# EAGLE schematic 4ESC v3.1.1 (EAGLE 6.5.0)

## Sheet 1 of 5
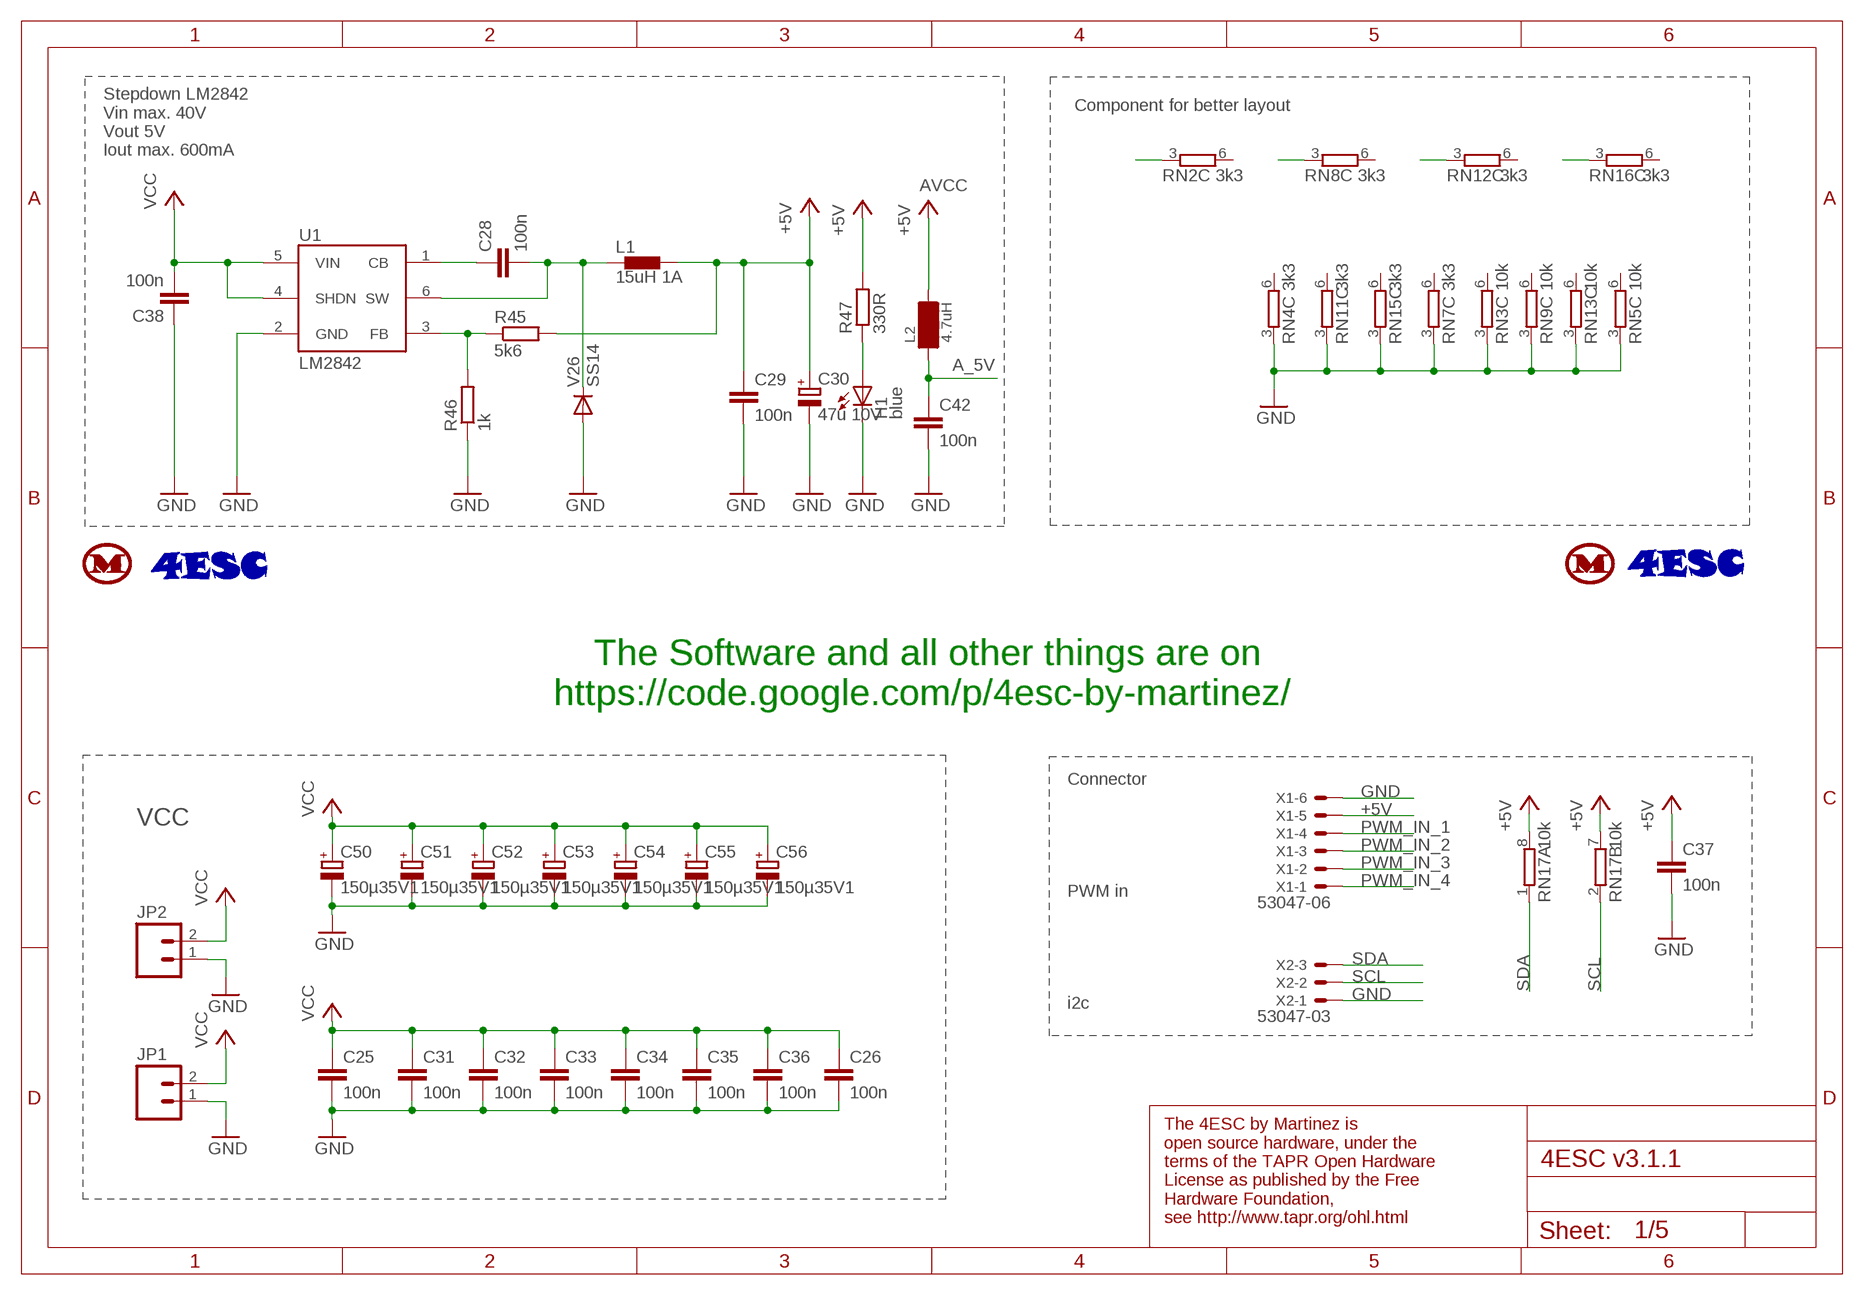
[diagram p0: schematic, sheet 1]

### Parts
C25  100n  C-EUC0603K  [C0603K]
C26  100n  C-EUC0603K  [C0603K]
C28  100n  C-EUC0603K  [C0603K]
C29  100n  C-EUC0603K  [C0603K]
C30  47u 10V  CPOL-EUC/6032-28R  [C/6032-28R]
C31  100n  C-EUC0603K  [C0603K]
C32  100n  C-EUC0603K  [C0603K]
C33  100n  C-EUC0603K  [C0603K]
C34  100n  C-EUC0603K  [C0603K]
C35  100n  C-EUC0603K  [C0603K]
C36  100n  C-EUC0603K  [C0603K]
C37  100n  C-EUC0603K  [C0603K]
C38  100n  C-EUC1206  [C1206]
C42  100n  C-EUC0603K  [C0603K]
C50  150µ35V1  CPOL-EU  [ELKO_MARTINEZ]
C51  150µ35V1  CPOL-EU  [ELKO_MARTINEZ]
C52  150µ35V1  CPOL-EU  [ELKO_MARTINEZ]
C53  150µ35V1  CPOL-EU  [ELKO_MARTINEZ]
C54  150µ35V1  CPOL-EU  [ELKO_MARTINEZ]
C55  150µ35V1  CPOL-EU  [ELKO_MARTINEZ]
C56  150µ35V1  CPOL-EU  [ELKO_MARTINEZ]
H1  blue  LEDCHIPLED_0603  [CHIPLED_0603]
JP1  M021X02_NO_SILK  [1X02_NO_SILK]
JP2  M021X02_NO_SILK  [1X02_NO_SILK]
L1  15uH 1A  SUMIDA-CDRH4D28CDRH4D28  [CDRH4D28]
L2  4.7uH  L0805  [L0805]
R45  5k6  R-EU_R0603  [R0603]
R46  1k  R-EU_R0603  [R0603]
R47  330R  R-EU_R0603  [R0603]
RN2  3k3  4R-N0402ARV341  [4X0402ARV341]
RN3  10k  4R-N0402ARV341  [4X0402ARV341]
RN4  3k3  4R-N0402ARV341  [4X0402ARV341]
RN5  10k  4R-N0402ARV341  [4X0402ARV341]
RN7  3k3  4R-N0402ARV341  [4X0402ARV341]
RN8  3k3  4R-N0402ARV341  [4X0402ARV341]
RN9  10k  4R-N0402ARV341  [4X0402ARV341]
RN11  3k3  4R-N0402ARV341  [4X0402ARV341]
RN12  3k3  4R-N0402ARV341  [4X0402ARV341]
RN13  10k  4R-N0402ARV341  [4X0402ARV341]
RN15  3k3  4R-N0402ARV341  [4X0402ARV341]
RN16  3k3  4R-N0402ARV341  [4X0402ARV341]
RN17  10k  4R-N0402ARV341  [4X0402ARV341]
U1  LM2842  [SOT23-6]
U$1  M  [M]
U$2  M  [M]
U$3  4ESC_05MM  [4ESC_05MM_HOCH]
U$4  4ESC_05MM  [4ESC_05MM_HOCH]
V26  SS14  DIODE-DO214AC  [DO214AC]
X1  53047-06  [53047-06]
X2  53047-03  [53047-03]

### Nets
+5V: C29.1 C30.+ C37.1 L1.P$2 L2.2 R45.2 R47.2 RN17.7 RN17.8 X1.5 ; also sheet 2,3,4,5
A_5V: C42.1 L2.1 ; also sheet 2,3,4,5
GND: C25.2 C26.2 C29.2 C30.- C31.2 C32.2 C33.2 C34.2 C35.2 C36.2 C37.2 C38.1 C42.2 C50.- C50.-1(-) C51.- C51.-1(-) C52.- C52.-1(-) C53.- C53.-1(-) C54.- C54.-1(-) C55.- C55.-1(-) C56.- C56.-1(-) H1.C JP1.1 JP2.1 R46.1 RN3.3 RN4.3 RN5.3 RN7.3 RN9.3 RN11.3 RN13.3 RN15.3 U1.2(GND) V26.A X1.6 X2.1 ; also sheet 2,3,4,5
N$20: C28.2 L1.P$1 U1.6(SW) V26.C
N$34: C28.1 U1.1(CB)
N$47: R45.1 R46.2 U1.3(FB)
N$60: H1.A R47.1
PWM_IN_1: X1.4 ; also sheet 2
PWM_IN_2: X1.3 ; also sheet 3
PWM_IN_3: X1.2 ; also sheet 4
PWM_IN_4: X1.1 ; also sheet 5
SCL: RN17.2 X2.2 ; also sheet 2,3,4,5
SDA: RN17.1 X2.3 ; also sheet 2,3,4,5
SENSE_STAR_1: RN2.3 ; also sheet 2
SENSE_STAR_2: RN8.3 ; also sheet 3
SENSE_STAR_3: RN12.3 ; also sheet 4
SENSE_STAR_4: RN16.3 ; also sheet 5
VCC: C25.1 C26.1 C31.1 C32.1 C33.1 C34.1 C35.1 C36.1 C38.2 C50.+ C50.+1(+) C51.+ C51.+1(+) C52.+ C52.+1(+) C53.+ C53.+1(+) C54.+ C54.+1(+) C55.+ C55.+1(+) C56.+ C56.+1(+) JP1.2 JP2.2 U1.4(SHDN) U1.5(VIN) ; also sheet 2,3,4,5
Unconnected: RN2.6 RN3.6 RN4.6 RN5.6 RN7.6 RN8.6 RN9.6 RN11.6 RN12.6 RN13.6 RN15.6 RN16.6 RN17.3 RN17.4 RN17.5 RN17.6

### Notes on the sheet
- Component for better layout
- Stepdown LM2842
  Vin max. 40V
  Vout 5V
  Iout max. 600mA
- AVCC
- The Software and all other things are on
  https://code.google.com/p/4esc-by-martinez/
- VCC
- Connector
  
  
  
  
  
  PWM in
  
  
  
  
  
  i2c
- The 4ESC by Martinez is
  open source hardware, under the
  terms of the TAPR Open Hardware
  License as published by the Free
  Hardware Foundation,
  see http://www.tapr.org/ohl.html

## Sheet 2 of 5
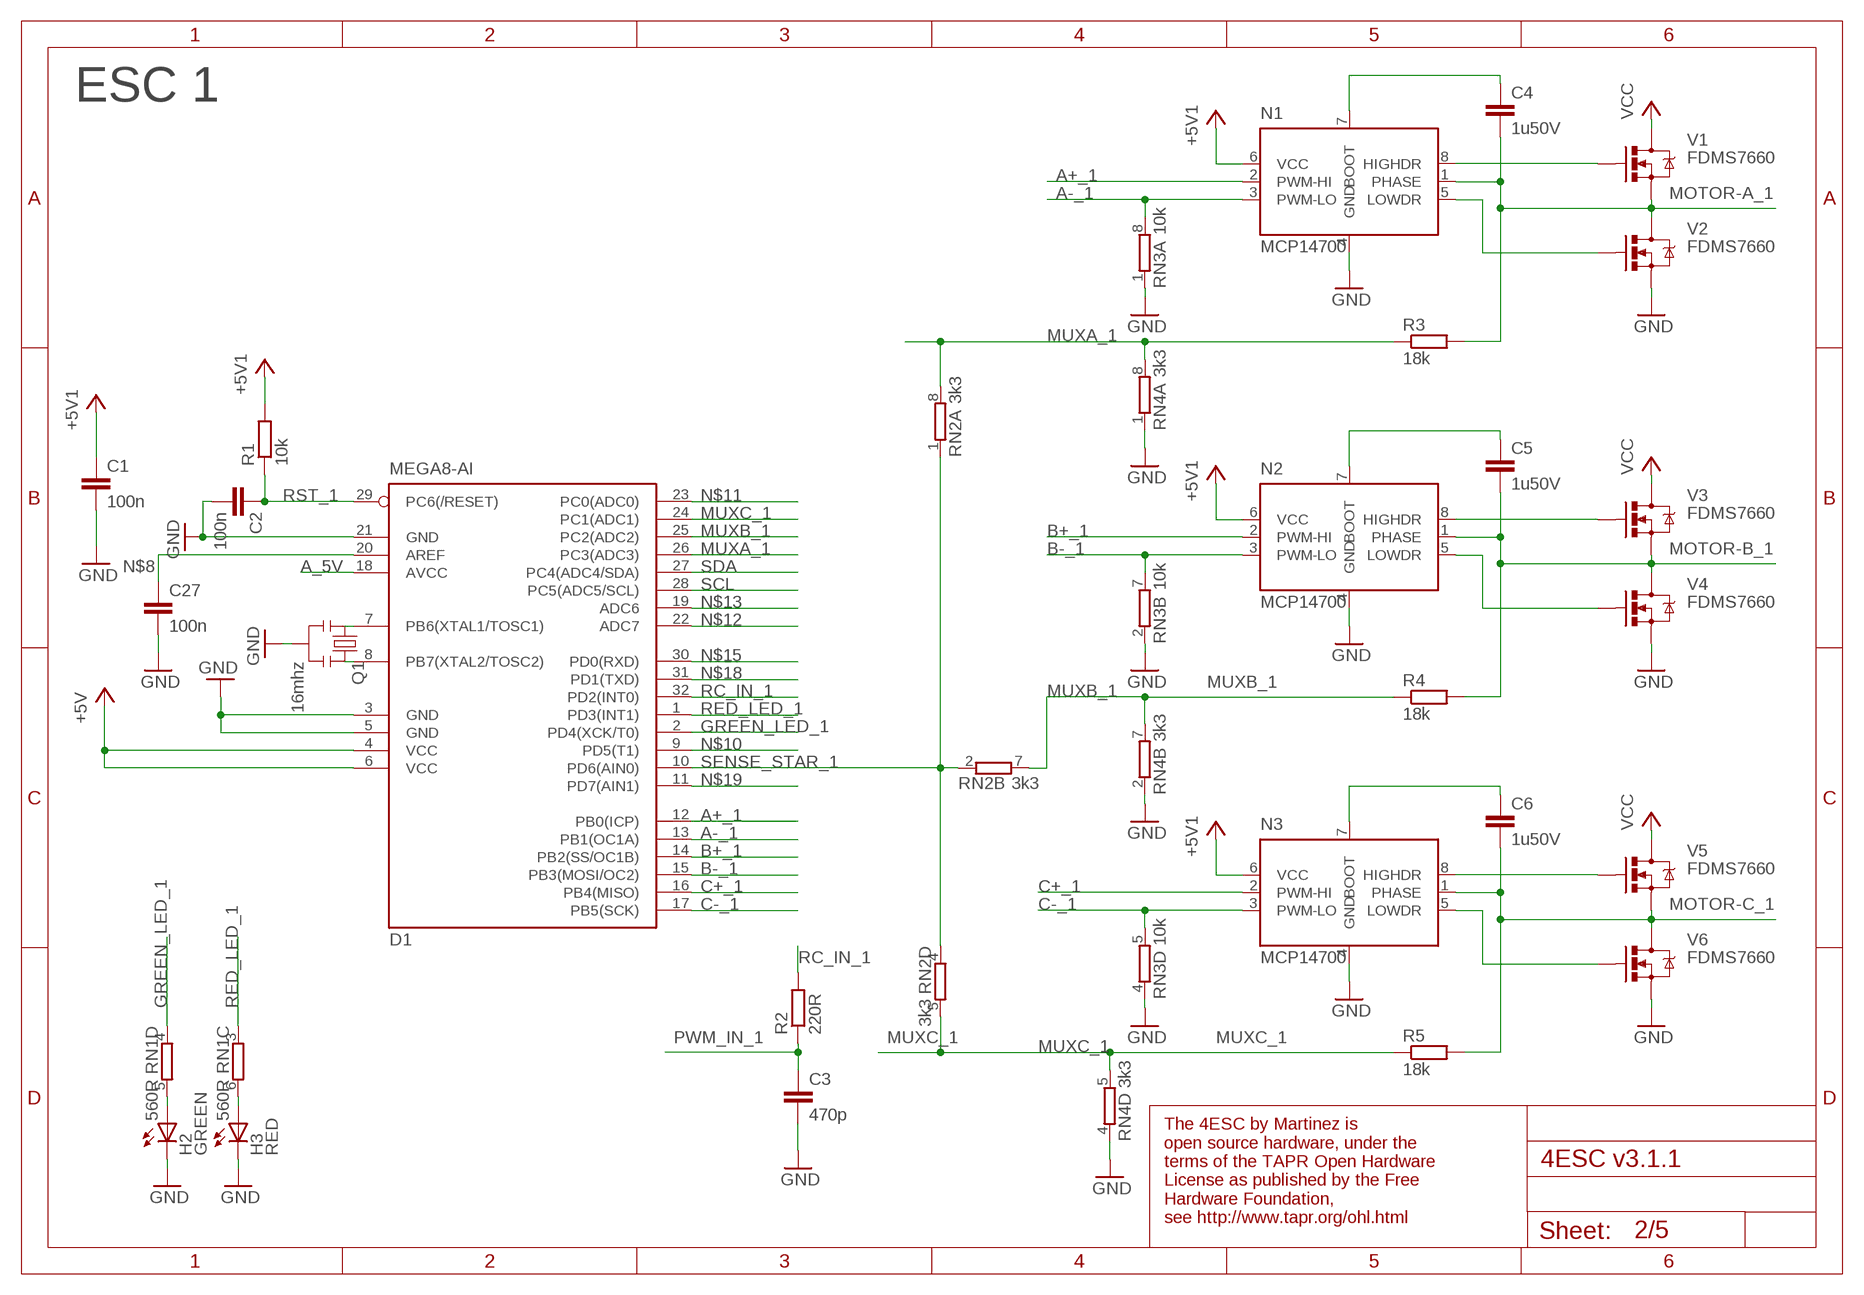
[diagram p1: schematic, sheet 2]

### Parts
C1  100n  C-EUC0603K  [C0603K]
C2  100n  C-EUC0603K  [C0603K]
C3  470p  C-EUC0603K  [C0603K]
C4  1u50V  C-EUC0805K  [C0805K]
C5  1u50V  C-EUC0805K  [C0805K]
C6  1u50V  C-EUC0805K  [C0805K]
C27  100n  C-EUC0603K  [C0603K]
D1  MEGA8-AI  [TQFP32-08]
H2  GREEN  LEDCHIPLED_0603  [CHIPLED_0603]
H3  RED  LEDCHIPLED_0603  [CHIPLED_0603]
N1  MCP14700  [DFN3X3P8]
N2  MCP14700  [DFN3X3P8]
N3  MCP14700  [DFN3X3P8]
Q1  16mhz  RESONATORSMD  [RESONATOR-SMD]
R1  10k  R-EU_R0603  [R0603]
R2  220R  R-EU_R0603  [R0603]
R3  18k  R-EU_R0603  [R0603]
R4  18k  R-EU_R0603  [R0603]
R5  18k  R-EU_R0603  [R0603]
RN1  560R  4R-N0402ARV341  [4X0402ARV341]
V1  FDMS7660  [POWER56]
V2  FDMS7660  [POWER56]
V3  FDMS7660  [POWER56]
V4  FDMS7660  [POWER56]
V5  FDMS7660  [POWER56]
V6  FDMS7660  [POWER56]

### Nets
+5V: C1.1 D1.4(VCC) D1.6(VCC) N1.6(VCC) N2.6(VCC) N3.6(VCC) R1.2 ; supply symbol labelled +5V1 ; also sheet 1,3,4,5
A+_1: D1.12(PB0(ICP)) N1.2(PWM-HI)
A-_1: D1.13(PB1(OC1A)) N1.3(PWM-LO) RN3.8
A_5V: D1.18(AVCC) ; also sheet 1,3,4,5
B+_1: D1.14(PB2(SS/OC1B)) N2.2(PWM-HI)
B-_1: D1.15(PB3(MOSI/OC2)) N2.3(PWM-LO) RN3.7
C+_1: D1.16(PB4(MISO)) N3.2(PWM-HI)
C-_1: D1.17(PB5(SCK)) N3.3(PWM-LO) RN3.5
GND: C1.2 C2.2 C3.2 C27.2 D1.3(GND) D1.5(GND) D1.21(GND) H2.C H3.C N1.4(GND) N2.4(GND) N3.4(GND) Q1.2 RN3.1 RN3.2 RN3.4 RN4.1 RN4.2 RN4.4 V2.P$1(S) V2.P$2(S) V2.P$3(S) V4.P$1(S) V4.P$2(S) V4.P$3(S) V6.P$1(S) V6.P$2(S) V6.P$3(S) ; also sheet 1,3,4,5
GREEN_LED_1: D1.2(PD4(XCK/T0)) RN1.4
MOTOR-A_1: C4.2 N1.1(PHASE) R3.2 V1.P$1(S) V1.P$2(S) V1.P$3(S) V2.P$5(D) V2.P$6(D) V2.P$7(D) V2.P$8(D) V2.P$9(D)
MOTOR-B_1: C5.2 N2.1(PHASE) R4.2 V3.P$1(S) V3.P$2(S) V3.P$3(S) V4.P$5(D) V4.P$6(D) V4.P$7(D) V4.P$8(D) V4.P$9(D)
MOTOR-C_1: C6.2 N3.1(PHASE) R5.2 V5.P$1(S) V5.P$2(S) V5.P$3(S) V6.P$5(D) V6.P$6(D) V6.P$7(D) V6.P$8(D) V6.P$9(D)
MUXA_1: D1.26(PC3(ADC3)) R3.1 RN2.8 RN4.8
MUXB_1: D1.25(PC2(ADC2)) R4.1 RN2.7 RN4.7
MUXC_1: D1.24(PC1(ADC1)) R5.1 RN2.5 RN4.5
N$1: N1.5(LOWDR) V2.P$4(G)
N$2: N2.5(LOWDR) V4.P$4(G)
N$2_1: D1.8(PB7(XTAL2/TOSC2)) Q1.3
N$3: N3.5(LOWDR) V6.P$4(G)
N$3_1: D1.7(PB6(XTAL1/TOSC1)) Q1.1
N$4: H3.A RN1.6
N$5: H2.A RN1.5
N$8: C27.1 D1.20(AREF)
N$10: D1.9(PD5(T1))
N$11: D1.23(PC0(ADC0))
N$12: D1.22(ADC7)
N$13: D1.19(ADC6)
N$15: D1.30(PD0(RXD))
N$16_1: N1.8(HIGHDR) V1.P$4(G)
N$16_2: N2.8(HIGHDR) V3.P$4(G)
N$16_3: N3.8(HIGHDR) V5.P$4(G)
N$18: D1.31(PD1(TXD))
N$19: D1.11(PD7(AIN1))
N$78_1: C4.1 N1.7(BOOT)
N$78_2: C5.1 N2.7(BOOT)
N$78_3: C6.1 N3.7(BOOT)
PWM_IN_1: C3.1 R2.1 ; also sheet 1
RC_IN_1: D1.32(PD2(INT0)) R2.2
RED_LED_1: D1.1(PD3(INT1)) RN1.3
RST_1: C2.1 D1.29(PC6(/RESET)) R1.1
SCL: D1.28(PC5(ADC5/SCL)) ; also sheet 1,3,4,5
SDA: D1.27(PC4(ADC4/SDA)) ; also sheet 1,3,4,5
SENSE_STAR_1: D1.10(PD6(AIN0)) RN2.1 RN2.2 RN2.4 ; also sheet 1
VCC: V1.P$5(D) V1.P$6(D) V1.P$7(D) V1.P$8(D) V1.P$9(D) V3.P$5(D) V3.P$6(D) V3.P$7(D) V3.P$8(D) V3.P$9(D) V5.P$5(D) V5.P$6(D) V5.P$7(D) V5.P$8(D) V5.P$9(D) ; also sheet 1,3,4,5
Unconnected: RN1.1 RN1.2 RN1.7 RN1.8

### Notes on the sheet
- ESC 1
- The 4ESC by Martinez is
  open source hardware, under the
  terms of the TAPR Open Hardware
  License as published by the Free
  Hardware Foundation,
  see http://www.tapr.org/ohl.html

## Sheet 3 of 5
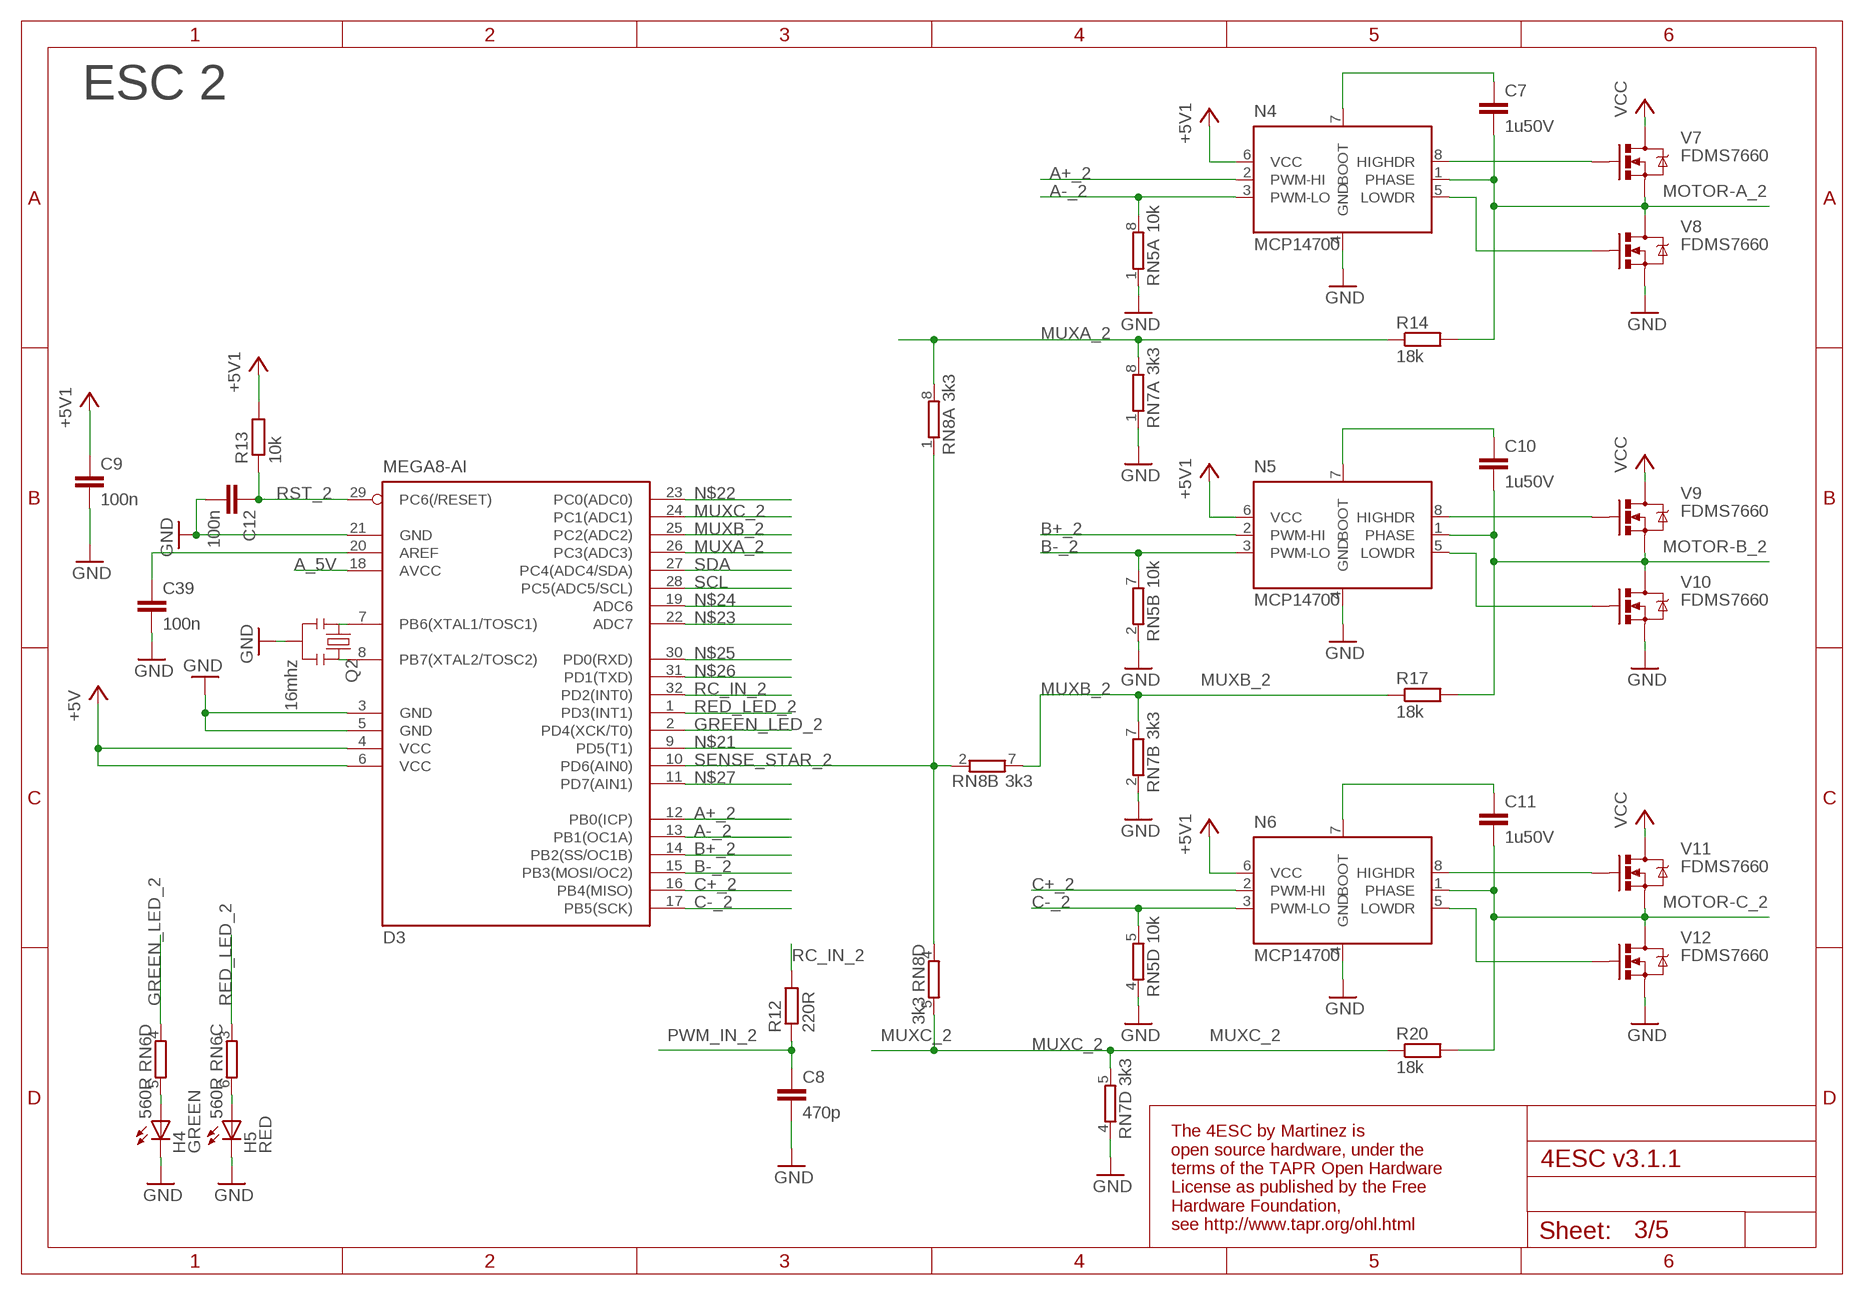
[diagram p2: schematic, sheet 3]

### Parts
C7  1u50V  C-EUC0805K  [C0805K]
C8  470p  C-EUC0603K  [C0603K]
C9  100n  C-EUC0603K  [C0603K]
C10  1u50V  C-EUC0805K  [C0805K]
C11  1u50V  C-EUC0805K  [C0805K]
C12  100n  C-EUC0603K  [C0603K]
C39  100n  C-EUC0603K  [C0603K]
D3  MEGA8-AI  [TQFP32-08]
H4  GREEN  LEDCHIPLED_0603  [CHIPLED_0603]
H5  RED  LEDCHIPLED_0603  [CHIPLED_0603]
N4  MCP14700  [DFN3X3P8]
N5  MCP14700  [DFN3X3P8]
N6  MCP14700  [DFN3X3P8]
Q2  16mhz  RESONATORSMD  [RESONATOR-SMD]
R12  220R  R-EU_R0603  [R0603]
R13  10k  R-EU_R0603  [R0603]
R14  18k  R-EU_R0603  [R0603]
R17  18k  R-EU_R0603  [R0603]
R20  18k  R-EU_R0603  [R0603]
RN6  560R  4R-N0402ARV341  [4X0402ARV341]
V7  FDMS7660  [POWER56]
V8  FDMS7660  [POWER56]
V9  FDMS7660  [POWER56]
V10  FDMS7660  [POWER56]
V11  FDMS7660  [POWER56]
V12  FDMS7660  [POWER56]

### Nets
+5V: C9.1 D3.4(VCC) D3.6(VCC) N4.6(VCC) N5.6(VCC) N6.6(VCC) R13.2 ; supply symbol labelled +5V1 ; also sheet 1,2,4,5
A+_2: D3.12(PB0(ICP)) N4.2(PWM-HI)
A-_2: D3.13(PB1(OC1A)) N4.3(PWM-LO) RN5.8
A_5V: D3.18(AVCC) ; also sheet 1,2,4,5
B+_2: D3.14(PB2(SS/OC1B)) N5.2(PWM-HI)
B-_2: D3.15(PB3(MOSI/OC2)) N5.3(PWM-LO) RN5.7
C+_2: D3.16(PB4(MISO)) N6.2(PWM-HI)
C-_2: D3.17(PB5(SCK)) N6.3(PWM-LO) RN5.5
GND: C8.2 C9.2 C12.2 C39.2 D3.3(GND) D3.5(GND) D3.21(GND) H4.C H5.C N4.4(GND) N5.4(GND) N6.4(GND) Q2.2 RN5.1 RN5.2 RN5.4 RN7.1 RN7.2 RN7.4 V8.P$1(S) V8.P$2(S) V8.P$3(S) V10.P$1(S) V10.P$2(S) V10.P$3(S) V12.P$1(S) V12.P$2(S) V12.P$3(S) ; also sheet 1,2,4,5
GREEN_LED_2: D3.2(PD4(XCK/T0)) RN6.4
MOTOR-A_2: C7.2 N4.1(PHASE) R14.2 V7.P$1(S) V7.P$2(S) V7.P$3(S) V8.P$5(D) V8.P$6(D) V8.P$7(D) V8.P$8(D) V8.P$9(D)
MOTOR-B_2: C10.2 N5.1(PHASE) R17.2 V9.P$1(S) V9.P$2(S) V9.P$3(S) V10.P$5(D) V10.P$6(D) V10.P$7(D) V10.P$8(D) V10.P$9(D)
MOTOR-C_2: C11.2 N6.1(PHASE) R20.2 V11.P$1(S) V11.P$2(S) V11.P$3(S) V12.P$5(D) V12.P$6(D) V12.P$7(D) V12.P$8(D) V12.P$9(D)
MUXA_2: D3.26(PC3(ADC3)) R14.1 RN7.8 RN8.8
MUXB_2: D3.25(PC2(ADC2)) R17.1 RN7.7 RN8.7
MUXC_2: D3.24(PC1(ADC1)) R20.1 RN7.5 RN8.5
N$2_2: D3.8(PB7(XTAL2/TOSC2)) Q2.3
N$3_2: D3.7(PB6(XTAL1/TOSC1)) Q2.1
N$6: N4.5(LOWDR) V8.P$4(G)
N$9: N5.5(LOWDR) V10.P$4(G)
N$14: N6.5(LOWDR) V12.P$4(G)
N$16: H4.A RN6.5
N$16_4: N4.8(HIGHDR) V7.P$4(G)
N$16_5: N5.8(HIGHDR) V9.P$4(G)
N$16_6: N6.8(HIGHDR) V11.P$4(G)
N$17: C39.1 D3.20(AREF)
N$21: D3.9(PD5(T1))
N$22: D3.23(PC0(ADC0))
N$23: D3.22(ADC7)
N$24: D3.19(ADC6)
N$25: D3.30(PD0(RXD))
N$26: D3.31(PD1(TXD))
N$27: D3.11(PD7(AIN1))
N$28: H5.A RN6.6
N$78_4: C7.1 N4.7(BOOT)
N$78_5: C10.1 N5.7(BOOT)
N$78_6: C11.1 N6.7(BOOT)
PWM_IN_2: C8.1 R12.1 ; also sheet 1
RC_IN_2: D3.32(PD2(INT0)) R12.2
RED_LED_2: D3.1(PD3(INT1)) RN6.3
RST_2: C12.1 D3.29(PC6(/RESET)) R13.1
SCL: D3.28(PC5(ADC5/SCL)) ; also sheet 1,2,4,5
SDA: D3.27(PC4(ADC4/SDA)) ; also sheet 1,2,4,5
SENSE_STAR_2: D3.10(PD6(AIN0)) RN8.1 RN8.2 RN8.4 ; also sheet 1
VCC: V7.P$5(D) V7.P$6(D) V7.P$7(D) V7.P$8(D) V7.P$9(D) V9.P$5(D) V9.P$6(D) V9.P$7(D) V9.P$8(D) V9.P$9(D) V11.P$5(D) V11.P$6(D) V11.P$7(D) V11.P$8(D) V11.P$9(D) ; also sheet 1,2,4,5
Unconnected: RN6.1 RN6.2 RN6.7 RN6.8

### Notes on the sheet
- ESC 2
- The 4ESC by Martinez is
  open source hardware, under the
  terms of the TAPR Open Hardware
  License as published by the Free
  Hardware Foundation,
  see http://www.tapr.org/ohl.html

## Sheet 4 of 5
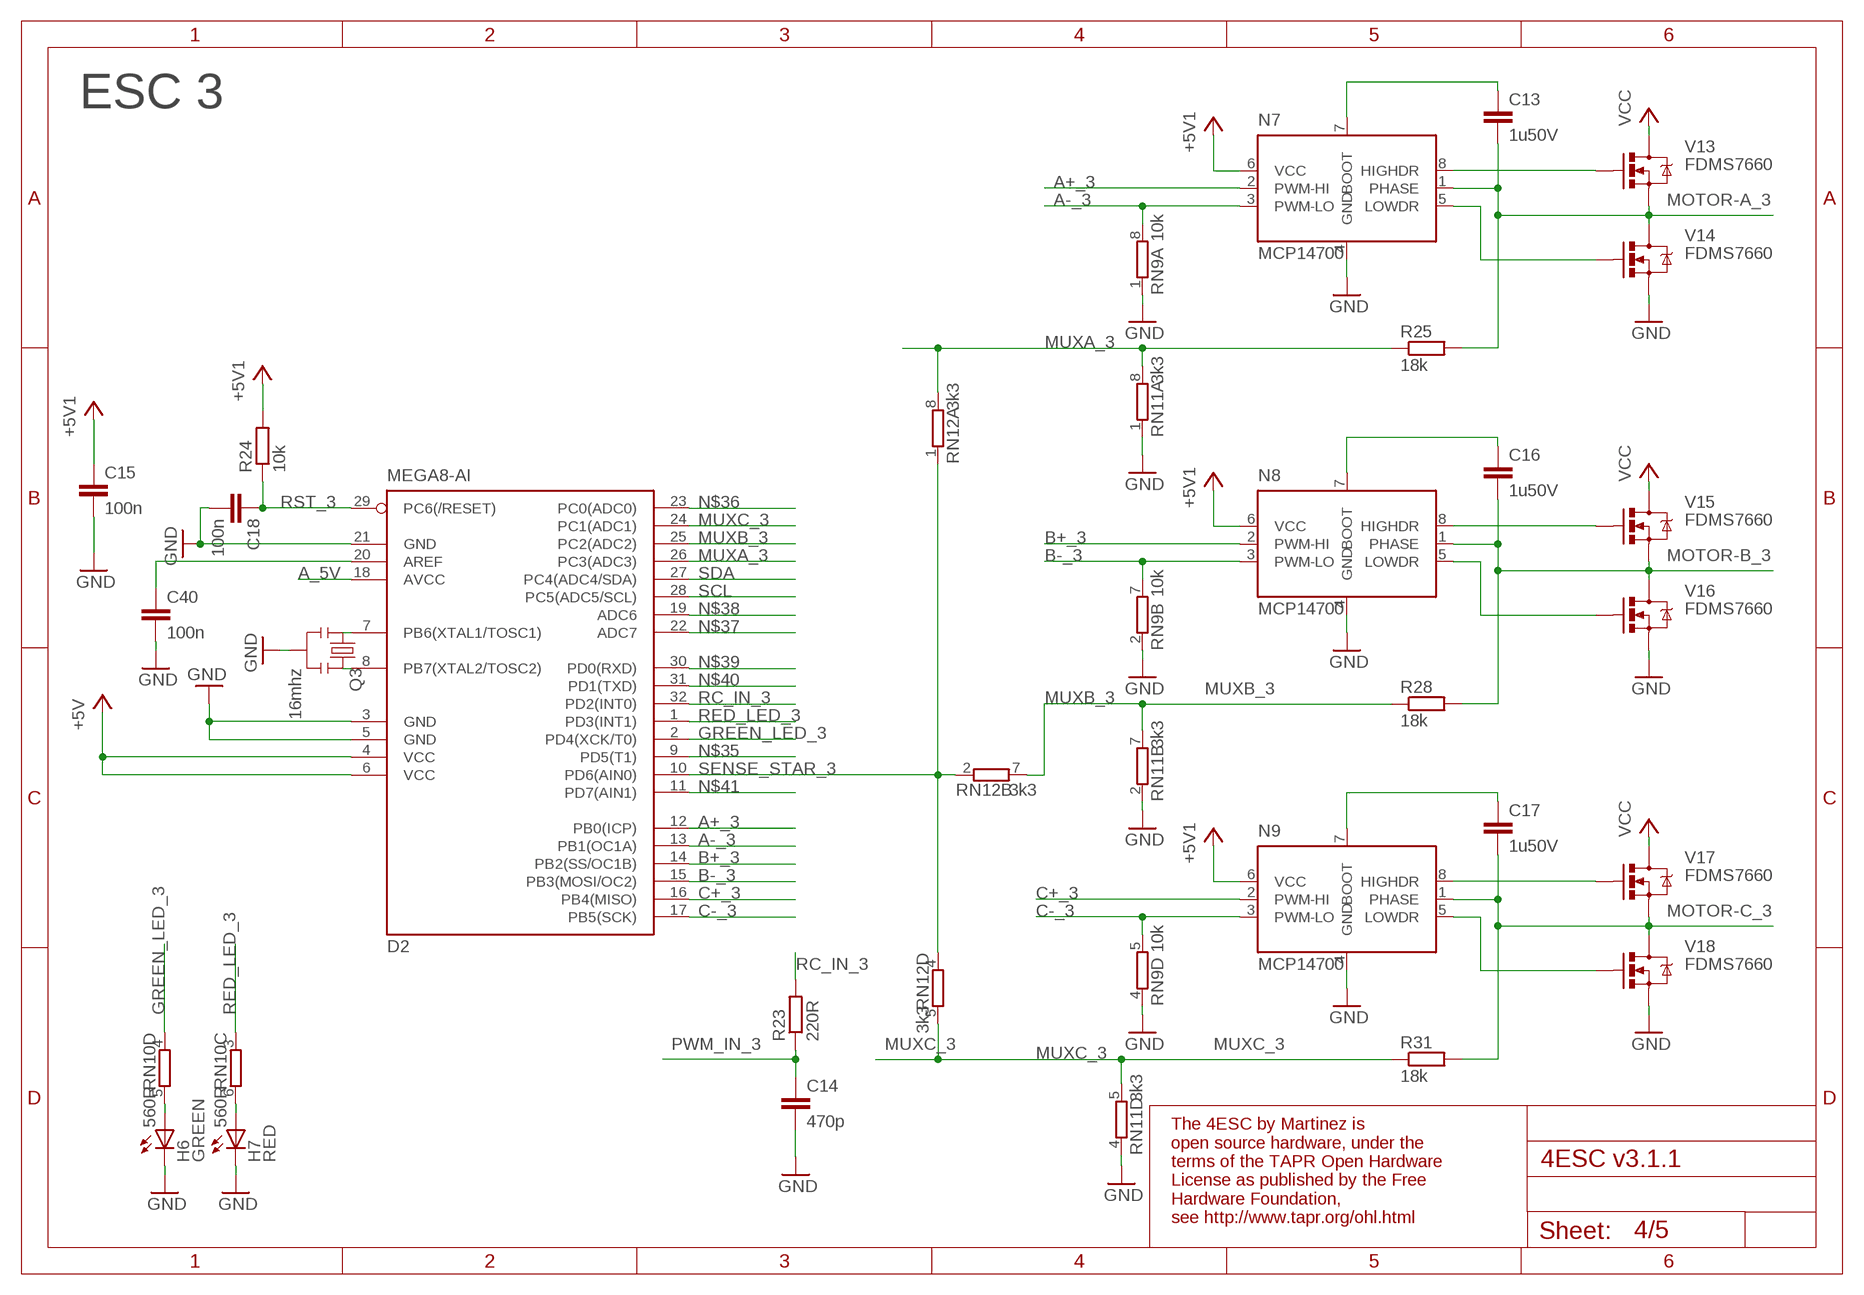
[diagram p3: schematic, sheet 4]

### Parts
C13  1u50V  C-EUC0805K  [C0805K]
C14  470p  C-EUC0603K  [C0603K]
C15  100n  C-EUC0603K  [C0603K]
C16  1u50V  C-EUC0805K  [C0805K]
C17  1u50V  C-EUC0805K  [C0805K]
C18  100n  C-EUC0603K  [C0603K]
C40  100n  C-EUC0603K  [C0603K]
D2  MEGA8-AI  [TQFP32-08]
H6  GREEN  LEDCHIPLED_0603  [CHIPLED_0603]
H7  RED  LEDCHIPLED_0603  [CHIPLED_0603]
N7  MCP14700  [DFN3X3P8]
N8  MCP14700  [DFN3X3P8]
N9  MCP14700  [DFN3X3P8]
Q3  16mhz  RESONATORSMD  [RESONATOR-SMD]
R23  220R  R-EU_R0603  [R0603]
R24  10k  R-EU_R0603  [R0603]
R25  18k  R-EU_R0603  [R0603]
R28  18k  R-EU_R0603  [R0603]
R31  18k  R-EU_R0603  [R0603]
RN10  560R  4R-N0402ARV341  [4X0402ARV341]
V13  FDMS7660  [POWER56]
V14  FDMS7660  [POWER56]
V15  FDMS7660  [POWER56]
V16  FDMS7660  [POWER56]
V17  FDMS7660  [POWER56]
V18  FDMS7660  [POWER56]

### Nets
+5V: C15.1 D2.4(VCC) D2.6(VCC) N7.6(VCC) N8.6(VCC) N9.6(VCC) R24.2 ; supply symbol labelled +5V1 ; also sheet 1,2,3,5
A+_3: D2.12(PB0(ICP)) N7.2(PWM-HI)
A-_3: D2.13(PB1(OC1A)) N7.3(PWM-LO) RN9.8
A_5V: D2.18(AVCC) ; also sheet 1,2,3,5
B+_3: D2.14(PB2(SS/OC1B)) N8.2(PWM-HI)
B-_3: D2.15(PB3(MOSI/OC2)) N8.3(PWM-LO) RN9.7
C+_3: D2.16(PB4(MISO)) N9.2(PWM-HI)
C-_3: D2.17(PB5(SCK)) N9.3(PWM-LO) RN9.5
GND: C14.2 C15.2 C18.2 C40.2 D2.3(GND) D2.5(GND) D2.21(GND) H6.C H7.C N7.4(GND) N8.4(GND) N9.4(GND) Q3.2 RN9.1 RN9.2 RN9.4 RN11.1 RN11.2 RN11.4 V14.P$1(S) V14.P$2(S) V14.P$3(S) V16.P$1(S) V16.P$2(S) V16.P$3(S) V18.P$1(S) V18.P$2(S) V18.P$3(S) ; also sheet 1,2,3,5
GREEN_LED_3: D2.2(PD4(XCK/T0)) RN10.4
MOTOR-A_3: C13.2 N7.1(PHASE) R25.2 V13.P$1(S) V13.P$2(S) V13.P$3(S) V14.P$5(D) V14.P$6(D) V14.P$7(D) V14.P$8(D) V14.P$9(D)
MOTOR-B_3: C16.2 N8.1(PHASE) R28.2 V15.P$1(S) V15.P$2(S) V15.P$3(S) V16.P$5(D) V16.P$6(D) V16.P$7(D) V16.P$8(D) V16.P$9(D)
MOTOR-C_3: C17.2 N9.1(PHASE) R31.2 V17.P$1(S) V17.P$2(S) V17.P$3(S) V18.P$5(D) V18.P$6(D) V18.P$7(D) V18.P$8(D) V18.P$9(D)
MUXA_3: D2.26(PC3(ADC3)) R25.1 RN11.8 RN12.8
MUXB_3: D2.25(PC2(ADC2)) R28.1 RN11.7 RN12.7
MUXC_3: D2.24(PC1(ADC1)) R31.1 RN11.5 RN12.5
N$2_3: D2.8(PB7(XTAL2/TOSC2)) Q3.3
N$3_3: D2.7(PB6(XTAL1/TOSC1)) Q3.1
N$7: C40.1 D2.20(AREF)
N$16_7: N7.8(HIGHDR) V13.P$4(G)
N$16_8: N8.8(HIGHDR) V15.P$4(G)
N$16_9: N9.8(HIGHDR) V17.P$4(G)
N$29: N7.5(LOWDR) V14.P$4(G)
N$30: N8.5(LOWDR) V16.P$4(G)
N$31: N9.5(LOWDR) V18.P$4(G)
N$32: H6.A RN10.5
N$35: D2.9(PD5(T1))
N$36: D2.23(PC0(ADC0))
N$37: D2.22(ADC7)
N$38: D2.19(ADC6)
N$39: D2.30(PD0(RXD))
N$40: D2.31(PD1(TXD))
N$41: D2.11(PD7(AIN1))
N$42: H7.A RN10.6
N$78_7: C13.1 N7.7(BOOT)
N$78_8: C16.1 N8.7(BOOT)
N$78_9: C17.1 N9.7(BOOT)
PWM_IN_3: C14.1 R23.1 ; also sheet 1
RC_IN_3: D2.32(PD2(INT0)) R23.2
RED_LED_3: D2.1(PD3(INT1)) RN10.3
RST_3: C18.1 D2.29(PC6(/RESET)) R24.1
SCL: D2.28(PC5(ADC5/SCL)) ; also sheet 1,2,3,5
SDA: D2.27(PC4(ADC4/SDA)) ; also sheet 1,2,3,5
SENSE_STAR_3: D2.10(PD6(AIN0)) RN12.1 RN12.2 RN12.4 ; also sheet 1
VCC: V13.P$5(D) V13.P$6(D) V13.P$7(D) V13.P$8(D) V13.P$9(D) V15.P$5(D) V15.P$6(D) V15.P$7(D) V15.P$8(D) V15.P$9(D) V17.P$5(D) V17.P$6(D) V17.P$7(D) V17.P$8(D) V17.P$9(D) ; also sheet 1,2,3,5
Unconnected: RN10.1 RN10.2 RN10.7 RN10.8

### Notes on the sheet
- ESC 3
- The 4ESC by Martinez is
  open source hardware, under the
  terms of the TAPR Open Hardware
  License as published by the Free
  Hardware Foundation,
  see http://www.tapr.org/ohl.html

## Sheet 5 of 5
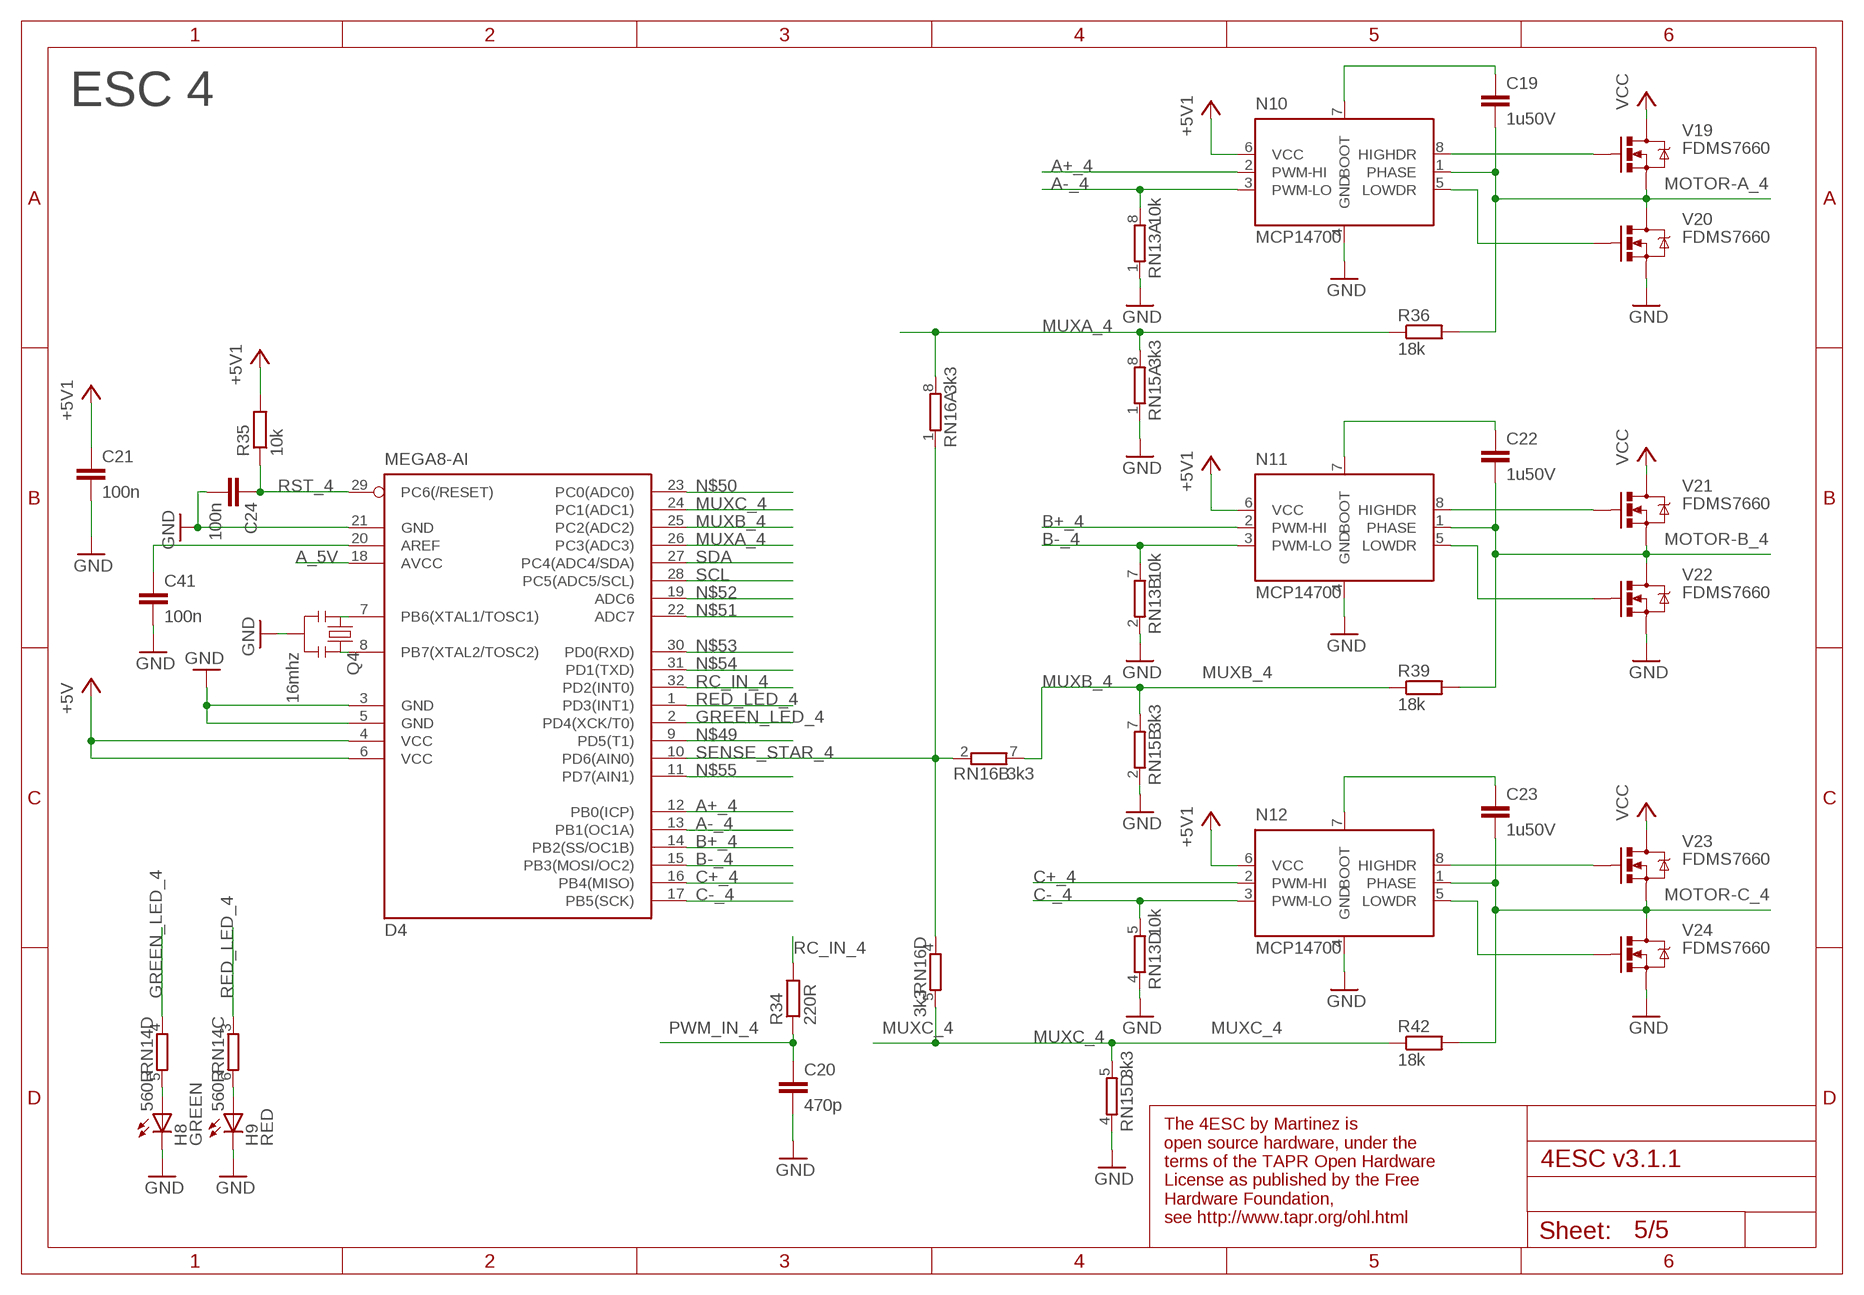
[diagram p4: schematic, sheet 5]

### Parts
C19  1u50V  C-EUC0805K  [C0805K]
C20  470p  C-EUC0603K  [C0603K]
C21  100n  C-EUC0603K  [C0603K]
C22  1u50V  C-EUC0805K  [C0805K]
C23  1u50V  C-EUC0805K  [C0805K]
C24  100n  C-EUC0603K  [C0603K]
C41  100n  C-EUC0603K  [C0603K]
D4  MEGA8-AI  [TQFP32-08]
H8  GREEN  LEDCHIPLED_0603  [CHIPLED_0603]
H9  RED  LEDCHIPLED_0603  [CHIPLED_0603]
N10  MCP14700  [DFN3X3P8]
N11  MCP14700  [DFN3X3P8]
N12  MCP14700  [DFN3X3P8]
Q4  16mhz  RESONATORSMD  [RESONATOR-SMD]
R34  220R  R-EU_R0603  [R0603]
R35  10k  R-EU_R0603  [R0603]
R36  18k  R-EU_R0603  [R0603]
R39  18k  R-EU_R0603  [R0603]
R42  18k  R-EU_R0603  [R0603]
RN14  560R  4R-N0402ARV341  [4X0402ARV341]
V19  FDMS7660  [POWER56]
V20  FDMS7660  [POWER56]
V21  FDMS7660  [POWER56]
V22  FDMS7660  [POWER56]
V23  FDMS7660  [POWER56]
V24  FDMS7660  [POWER56]

### Nets
+5V: C21.1 D4.4(VCC) D4.6(VCC) N10.6(VCC) N11.6(VCC) N12.6(VCC) R35.2 ; supply symbol labelled +5V1 ; also sheet 1,2,3,4
A+_4: D4.12(PB0(ICP)) N10.2(PWM-HI)
A-_4: D4.13(PB1(OC1A)) N10.3(PWM-LO) RN13.8
A_5V: D4.18(AVCC) ; also sheet 1,2,3,4
B+_4: D4.14(PB2(SS/OC1B)) N11.2(PWM-HI)
B-_4: D4.15(PB3(MOSI/OC2)) N11.3(PWM-LO) RN13.7
C+_4: D4.16(PB4(MISO)) N12.2(PWM-HI)
C-_4: D4.17(PB5(SCK)) N12.3(PWM-LO) RN13.5
GND: C20.2 C21.2 C24.2 C41.2 D4.3(GND) D4.5(GND) D4.21(GND) H8.C H9.C N10.4(GND) N11.4(GND) N12.4(GND) Q4.2 RN13.1 RN13.2 RN13.4 RN15.1 RN15.2 RN15.4 V20.P$1(S) V20.P$2(S) V20.P$3(S) V22.P$1(S) V22.P$2(S) V22.P$3(S) V24.P$1(S) V24.P$2(S) V24.P$3(S) ; also sheet 1,2,3,4
GREEN_LED_4: D4.2(PD4(XCK/T0)) RN14.4
MOTOR-A_4: C19.2 N10.1(PHASE) R36.2 V19.P$1(S) V19.P$2(S) V19.P$3(S) V20.P$5(D) V20.P$6(D) V20.P$7(D) V20.P$8(D) V20.P$9(D)
MOTOR-B_4: C22.2 N11.1(PHASE) R39.2 V21.P$1(S) V21.P$2(S) V21.P$3(S) V22.P$5(D) V22.P$6(D) V22.P$7(D) V22.P$8(D) V22.P$9(D)
MOTOR-C_4: C23.2 N12.1(PHASE) R42.2 V23.P$1(S) V23.P$2(S) V23.P$3(S) V24.P$5(D) V24.P$6(D) V24.P$7(D) V24.P$8(D) V24.P$9(D)
MUXA_4: D4.26(PC3(ADC3)) R36.1 RN15.8 RN16.8
MUXB_4: D4.25(PC2(ADC2)) R39.1 RN15.7 RN16.7
MUXC_4: D4.24(PC1(ADC1)) R42.1 RN15.5 RN16.5
N$2_4: D4.8(PB7(XTAL2/TOSC2)) Q4.3
N$3_4: D4.7(PB6(XTAL1/TOSC1)) Q4.1
N$16_10: N10.8(HIGHDR) V19.P$4(G)
N$16_11: N11.8(HIGHDR) V21.P$4(G)
N$16_12: N12.8(HIGHDR) V23.P$4(G)
N$33: C41.1 D4.20(AREF)
N$43: N10.5(LOWDR) V20.P$4(G)
N$44: N11.5(LOWDR) V22.P$4(G)
N$45: N12.5(LOWDR) V24.P$4(G)
N$46: H8.A RN14.5
N$49: D4.9(PD5(T1))
N$50: D4.23(PC0(ADC0))
N$51: D4.22(ADC7)
N$52: D4.19(ADC6)
N$53: D4.30(PD0(RXD))
N$54: D4.31(PD1(TXD))
N$55: D4.11(PD7(AIN1))
N$56: H9.A RN14.6
N$78_10: C19.1 N10.7(BOOT)
N$78_11: C22.1 N11.7(BOOT)
N$78_12: C23.1 N12.7(BOOT)
PWM_IN_4: C20.1 R34.1 ; also sheet 1
RC_IN_4: D4.32(PD2(INT0)) R34.2
RED_LED_4: D4.1(PD3(INT1)) RN14.3
RST_4: C24.1 D4.29(PC6(/RESET)) R35.1
SCL: D4.28(PC5(ADC5/SCL)) ; also sheet 1,2,3,4
SDA: D4.27(PC4(ADC4/SDA)) ; also sheet 1,2,3,4
SENSE_STAR_4: D4.10(PD6(AIN0)) RN16.1 RN16.2 RN16.4 ; also sheet 1
VCC: V19.P$5(D) V19.P$6(D) V19.P$7(D) V19.P$8(D) V19.P$9(D) V21.P$5(D) V21.P$6(D) V21.P$7(D) V21.P$8(D) V21.P$9(D) V23.P$5(D) V23.P$6(D) V23.P$7(D) V23.P$8(D) V23.P$9(D) ; also sheet 1,2,3,4
Unconnected: RN14.1 RN14.2 RN14.7 RN14.8

### Notes on the sheet
- ESC 4
- The 4ESC by Martinez is
  open source hardware, under the
  terms of the TAPR Open Hardware
  License as published by the Free
  Hardware Foundation,
  see http://www.tapr.org/ohl.html

## Library data of the parts
C1 C2 C9 C12 C15 C18 C21 C24 C27 C39-C41 = resistor:C-EU: CAPACITOR, European symbol
C3-C8 C10 C11 C13 C14 C16 C17 C19 C20 C22 C23 C25 C26 C28 C29 C31-C38 C42 = rcl:C-EU: CAPACITOR, European symbol
C30 C50-C56 = rcl:CPOL-EU: POLARIZED CAPACITOR, European symbol
D1-D4 = atmel:MEGA8: MICROCONTROLLER 8 Kbytes FLASH, 1 kbytes SRAM, 512 bytes EEPROM, USART, 6-channel 10 bit ADC, 2-channel 8 bit ADC Pin compatible with Atmega48, ATMega88, ATMega168 Source: avr.lbr; MPN: ATMEGA8-16AU; OC_FARNELL: 9171371; OC_NEWARK: 73M8863
H1-H9 = led:LED: LED OSRAM: - CHIPLED LG R971, LG N971, LY N971, LG Q971, LY Q971, LO R971, LY R971 LH N974, LH R974 LS Q976, LO Q976, LY Q976 LO Q996 - Hyper CHIPLED LW Q18S LB Q993, LB Q99A, LB R99A - SideLED LS A670, LO A670, LY A670, LG A670, LP A670 LB A673, LV A673, LT A673, LW A673 LH A674 LY A675 LS A676, LA A676, LO A676, LY A676, LW A676 LS A679, LY A679, LG A679 - Hyper Micro SIDELED® LS Y876, LA Y876, LO Y876, LY Y876 LT Y87S - SmartLED LW L88C, LW L88S LB L89C, LB L89S, LG L890 LS L89K, LO L89K, LY L89K LS L896, LA L896, LO L896, LY L896 - TOPLED LS T670, LO T670, LY T670, LG T670, LP T670 LSG T670, LSP T670, LSY T670, LOP T670, LYG T670 LG T671, LOG T671, LSG T671 LB T673, LV T673, LT T673, LW T673 LH T674 LS T676, LA T676, LO T676, LY T676, LB T676, LH T676, LSB T676, LW T676 LB T67C, LV T67C, LT T67C, LS T67K, LO T67K, LY T67K, LW E67C LS E67B, LA E67B, LO E67B, LY E67B, LB E67C, LV E67C, LT E67C LW T67C LS T679, LY T679, LG T679 LS T770, LO T770, LY T770, LG T770, LP T770 LB T773, LV T773, LT T773, LW T773 LH T774 LS E675, LA E675, LY E675, LS T675 LS T776, LA T776, LO T776, LY T776, LB T776 LHGB T686 LT T68C, LB T68C - Hyper Mini TOPLED® LB M676 - Mini TOPLED Santana® LG M470 LS M47K, LO M47K, LY M47K Source: http://www.osram.convergy.de LUXEON: - LUMILED® LXK2-PW12-R00, LXK2-PW12-S00, LXK2-PW14-U00, LXK2-PW14-V00 LXK2-PM12-R00, LXK2-PM12-S00, LXK2-PM14-U00 LXK2-PE12-Q00, LXK2-PE12-R00, LXK2-PE12-S00, LXK2-PE14-T00, LXK2-PE14-U00 LXK2-PB12-K00, LXK2-PB12-L00, LXK2-PB12-M00, LXK2-PB14-N00, LXK2-PB14-P00, LXK2-PB14-Q00 LXK2-PR12-L00, LXK2-PR12-M00, LXK2-PR14-Q00, LXK2-PR14-R00 LXK2-PD12-Q00, LXK2-PD12-R00, LXK2-PD12-S00 LXK2-PH12-R00, LXK2-PH12-S00 LXK2-PL12-P00, LXK2-PL12-Q00, LXK2-PL12-R00 Source: www.luxeon.com KINGBRIGHT: KA-3528ASYC Source: www.kingbright.com
JP1 JP2 = SparkFun:M02: Header 2 Standard 2-pin 0.1" header. Use with straight break away headers (SKU : PRT-00116), right angle break away headers (PRT-00553), swiss pins (PRT-00743), machine pins (PRT-00117), and female headers (PRT-00115). Molex polarized connector foot print use with SKU : PRT-08233 with associated crimp pins and housings.
L1 = spulen-martinez:SUMIDA-CDRH4D28
L2 = divers:L: Coil, European symbol
N1-N12 = microchip:MCP14700
Q1-Q4 = SparkFun:RESONATOR: Resonator Small SMD resonator. This is the itty bitty 10/20MHz resonators with built in caps. CSTCE10M0G55 and CSTCE20M0V53. Footprint has been reviewed closely but hasn't been tested yet.
R1-R5 R12-R14 R17 R20 R23-R25 R28 R31 R34-R36 R39 R42 = resistor:R-EU_: RESISTOR, European symbol
R45-R47 = rcl:R-EU_: RESISTOR, European symbol
RN1-RN17 = resistor-dil:4R-N: Array Chip Resistor Source: RS Component / Phycomp; OC_FARNELL: unknown; OC_NEWARK: unknown
U1 = texas:LM2842: Farnell: http://de.farnell.com/texas-instruments/lm2842xmk-adjl-nopb/buck-42vin-550khz-0-6a-6tsot/dp/2102673 Mouser: http://de.mouser.com/ProductDetail/Texas-Instruments/LM2842XMK-ADJL-NOPB/?qs=sGAEpiMZZMvu8NZDyZ4K0Zt2JOvEAVv6 Datasheet: http://www.farnell.com/datasheets/1685591.pdf
U$1 U$2 = Zeichen:M
U$3 U$4 = Zeichen:4ESC_05MM
V1-V24 = SparkFun:FDMS7660: Fairchild FDMS7660 30 V, 2.8 mΩ Features - Max rDS(on) = 2.8 mΩ at VGS = 10 V, ID = 25 A - Max rDS(on) = 3.5 mΩ at VGS = 4.5 V, ID = 19 A - Advanced Package and Silicon combination for low rDS(on) and high efficiency - Next generation enhanced body diode technology, engineered for soft recovery. Provides Schottky-like performance with minimum EMI in sync buck converter applications - MSL1 robust package design - 100% UIL tested - RoHS Compliant
V26 = diode:DIODE-: DIODE
X1 = con-molex:53?-06: CONNECTOR wire to board 1.25 mm (.049 inch) pitch header; MPN: 53047-0610-C; OC_FARNELL: 9733078; OC_NEWARK: 03M2965
X2 = con-molex:53?-03: CONNECTOR wire to board 1.25 mm (.049 inch) pitch header; MPN: 530470310; OC_FARNELL: 9732853; OC_NEWARK: 14R5412